# EAGLE design bridge (EAGLE 9.6.2)
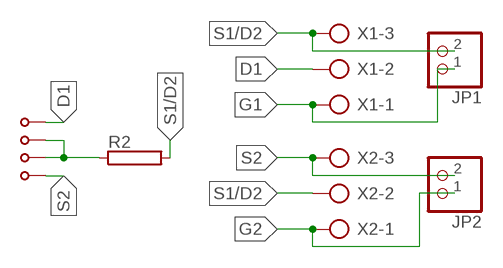
[diagram p0: schematic, sheet 1]

## Parts
JP1  PINHD-1X2  [1X02]
JP2  PINHD-1X2  [1X02]
R2  RKH216-8  [KH216-8]
U$1  BANANA-JACK  [BANANA-PRINT]
U$2  BANANA-JACK  [BANANA-PRINT]
U$3  BANANA-JACK  [BANANA-PRINT]
U$4  BANANA-JACK  [BANANA-PRINT]
X1  AK300/3  [AK300/3]
X2  AK300/3  [AK300/3]

## Nets
D1: U$1.P$1(PIN) X1.2
G1: JP1.1 X1.1
G2: JP2.1 X2.1
N$1: R2.1 U$2.P$1(PIN) U$3.P$1(PIN)
S1/D2: JP1.2 R2.2 X1.3 X2.2
S2: JP2.2 U$4.P$1(PIN) X2.3

## Library data of the parts
JP1 JP2 = pinhead:PINHD-1X2: PIN HEADER
R2 = resistor-power:R: Power Resitor; OC_FARNELL: unknown; OC_NEWARK: unknown
U$1-U$4 = con-banana:BANANA-JACK
X1 X2 = con-ptr500:AK300/3: CONNECTOR; OC_FARNELL: unknown; OC_NEWARK: unknown

## Board
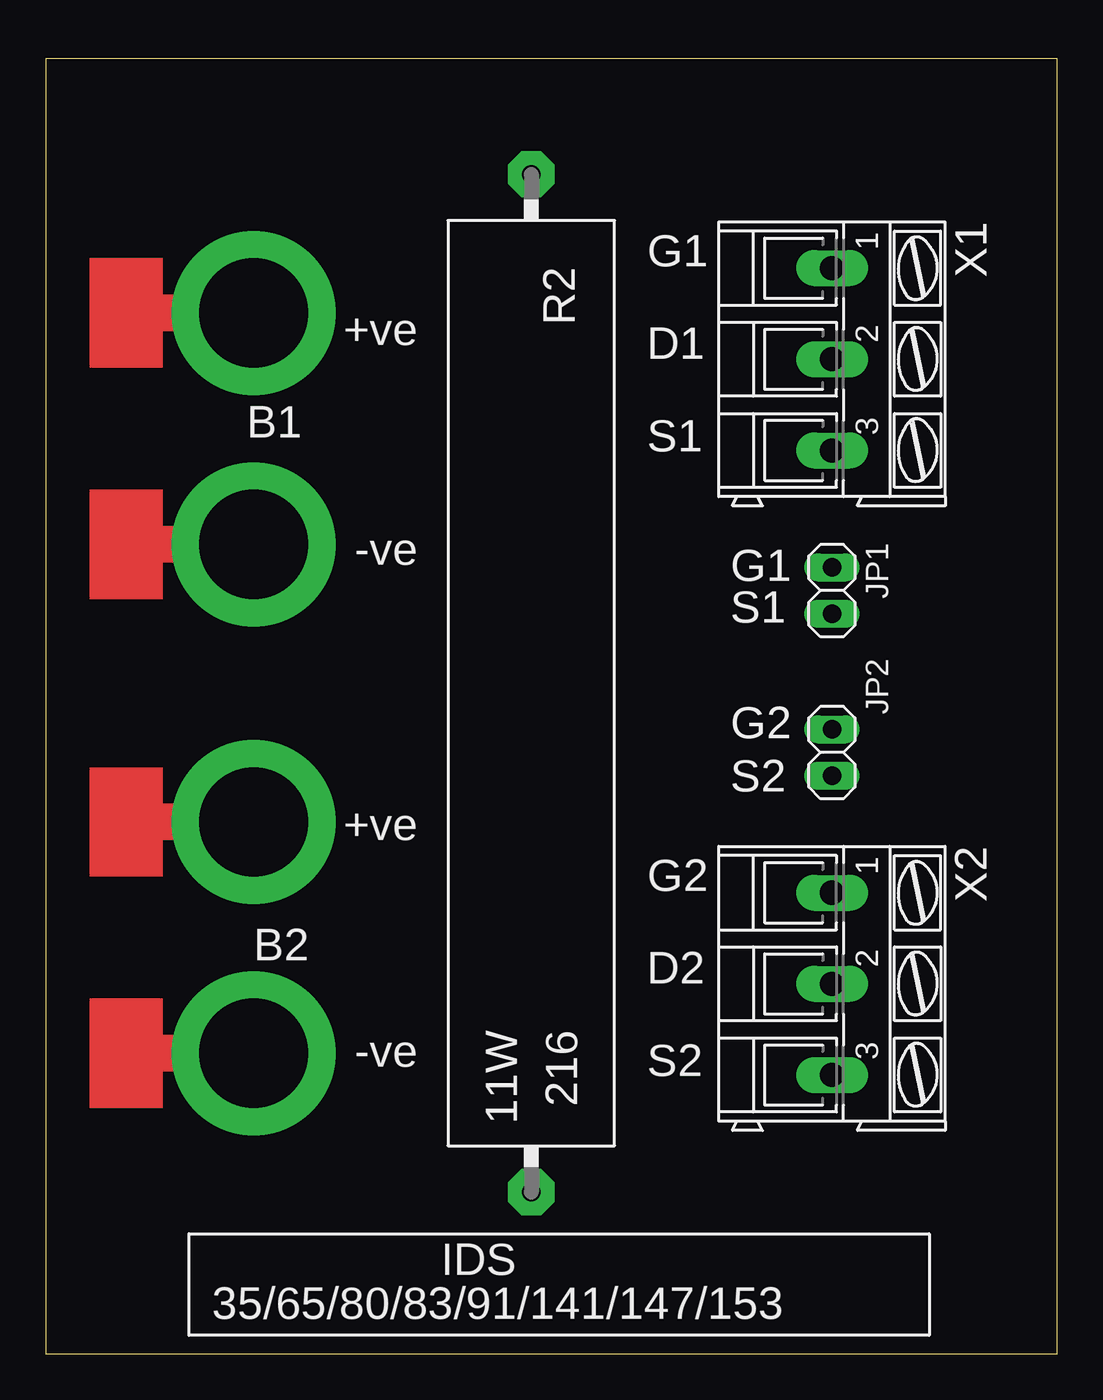
[diagram p1: board, top side]
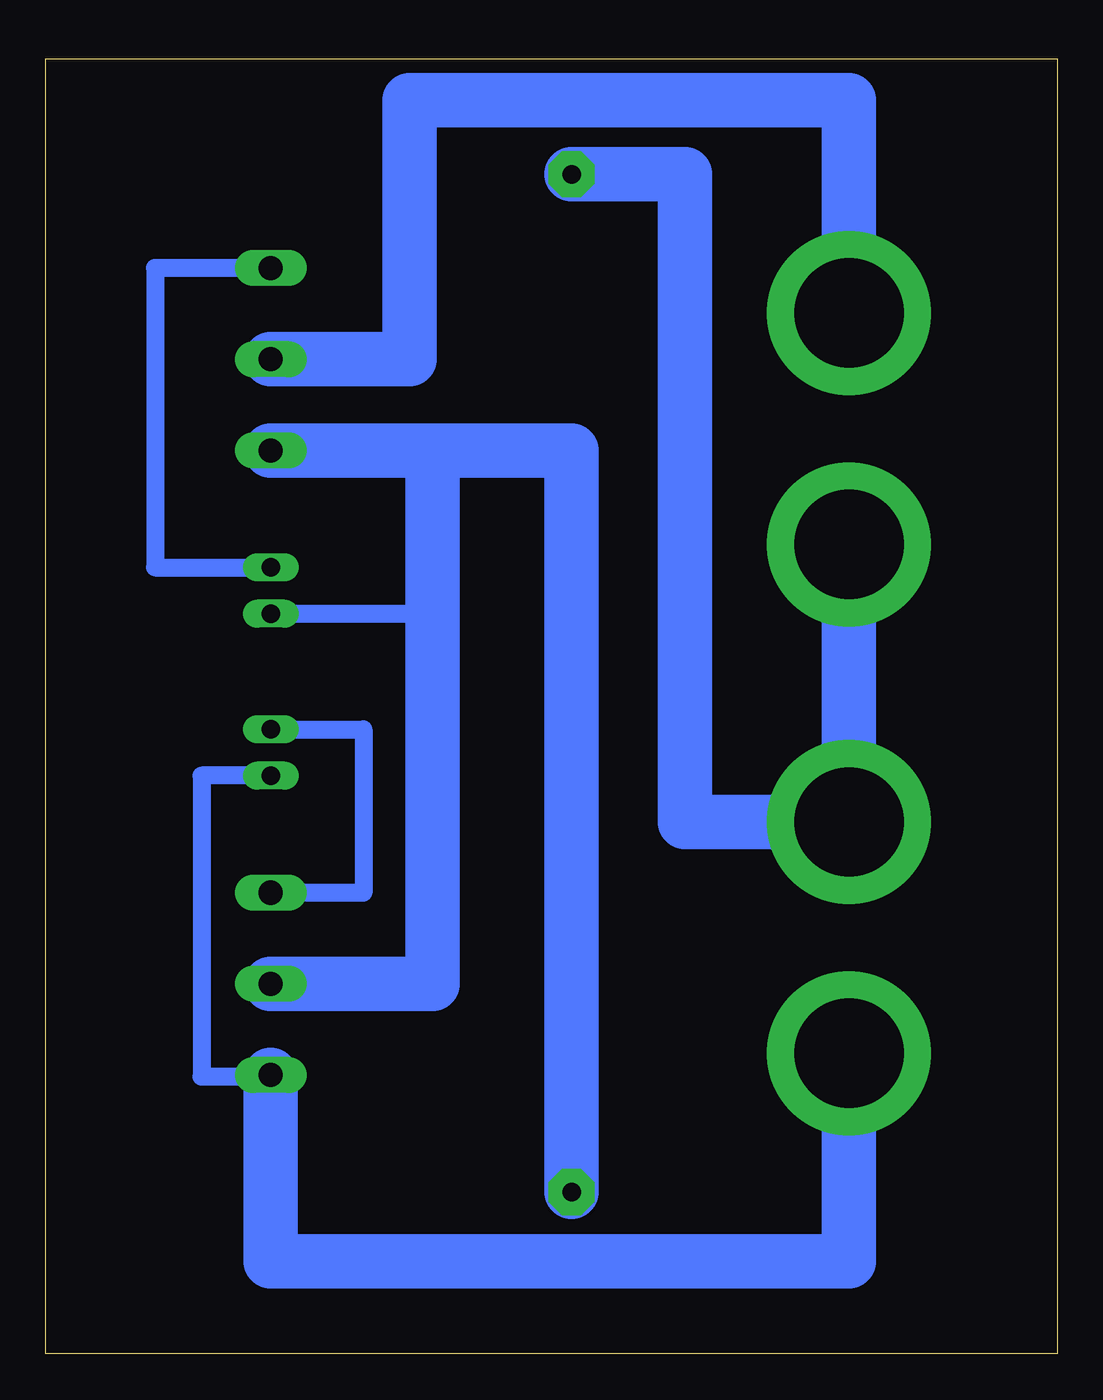
[diagram p2: board, bottom side, seen from below]

Size 55.55 x 71.11 mm. Coordinates in mm from the lower left corner, seen from the top.
Outline: 0,0 55.55,0 55.55,71.11 0,71.11 0,0
Copper layers (1*16): Top 0.035mm / dielectric 1.5mm / Bottom 0.035mm
Design rules "default *": minimum track width 1mm, minimum drill 0.35mm, track to track 0.7mm, track to pad 0.7mm, pad to pad 0.7mm, via to via 6mil, smd to smd 6mil, copper to edge 40mil, drill to drill 6mil, minimum pad ring 10mil, minimum via ring 8mil, stop-mask expansion 4mil, vias tented up to drill 0mil, thermal gap 10mil

### Footprints (pad centres in the part's own frame; a part is rotated, then mirrored left to right if it is on the bottom)
1X02 = drill 1.016 long: 1 -1.27,0; 2 1.27,0
KH216-8 = drill 1.016 pad 2.54 octagon: 1 -27.94,0; 2 27.94,0
BANANA-PRINT = drill 6 pad 9: P$1 0,0
AK300/3 = drill 1.321 long: 1 -5.004,0; 2 0,0; 3 5.004,0

### Placement (x,y rotation side)
JP1  43.18,41.91 270 top
JP2  43.18,33.02 270 top
R2  26.67,36.83 270 top
U$1  11.43,57.15 90 top
U$2  11.43,44.45 90 top
U$3  11.43,29.21 90 top
U$4  11.43,16.51 90 top
X1  43.18,54.61 270 top
X2  43.18,20.32 270 top

### Tracks (layer width: path | path; a pad name or v marks a point on that pad's centre or on a via)
D1
  Bottom 3: U$1.P$1 11.43,68.83 35.56,68.83 35.56,54.61 X1.2
G1
  Bottom 1: X1.1 49.53,59.61 49.53,43.18 JP1.1
G2
  Bottom 1: JP2.1 38.1,34.29 38.1,25.32 X2.1
N$1
  Bottom 3: U$2.P$1 U$3.P$1 20.43,29.21 20.43,64.77 R2.1
S1/D2
  Bottom 1: JP1.2 34.29,40.64
  Bottom 3: X2.2 34.29,20.32 34.29,40.64 34.29,49.61 X1.3 26.67,49.61 R2.2
S2
  Bottom 1: JP2.2 46.99,31.75 46.99,15.24 43.18,15.24 X2.3
  Bottom 3: U$4.P$1 11.43,5.08 43.18,5.08 X2.3

### Text on the board
tNames: G1 | +ve | D1 | B1 | S1 | -ve | G1 | S1 | G2 | S2 | +ve | G2 | B2 | D2 | -ve | S2 | IDS | 35/65/80/83/91/141/147/153